# EAGLE design stwin_inclinometer (EAGLE 9.6.2)

## Sheet 1 of 3
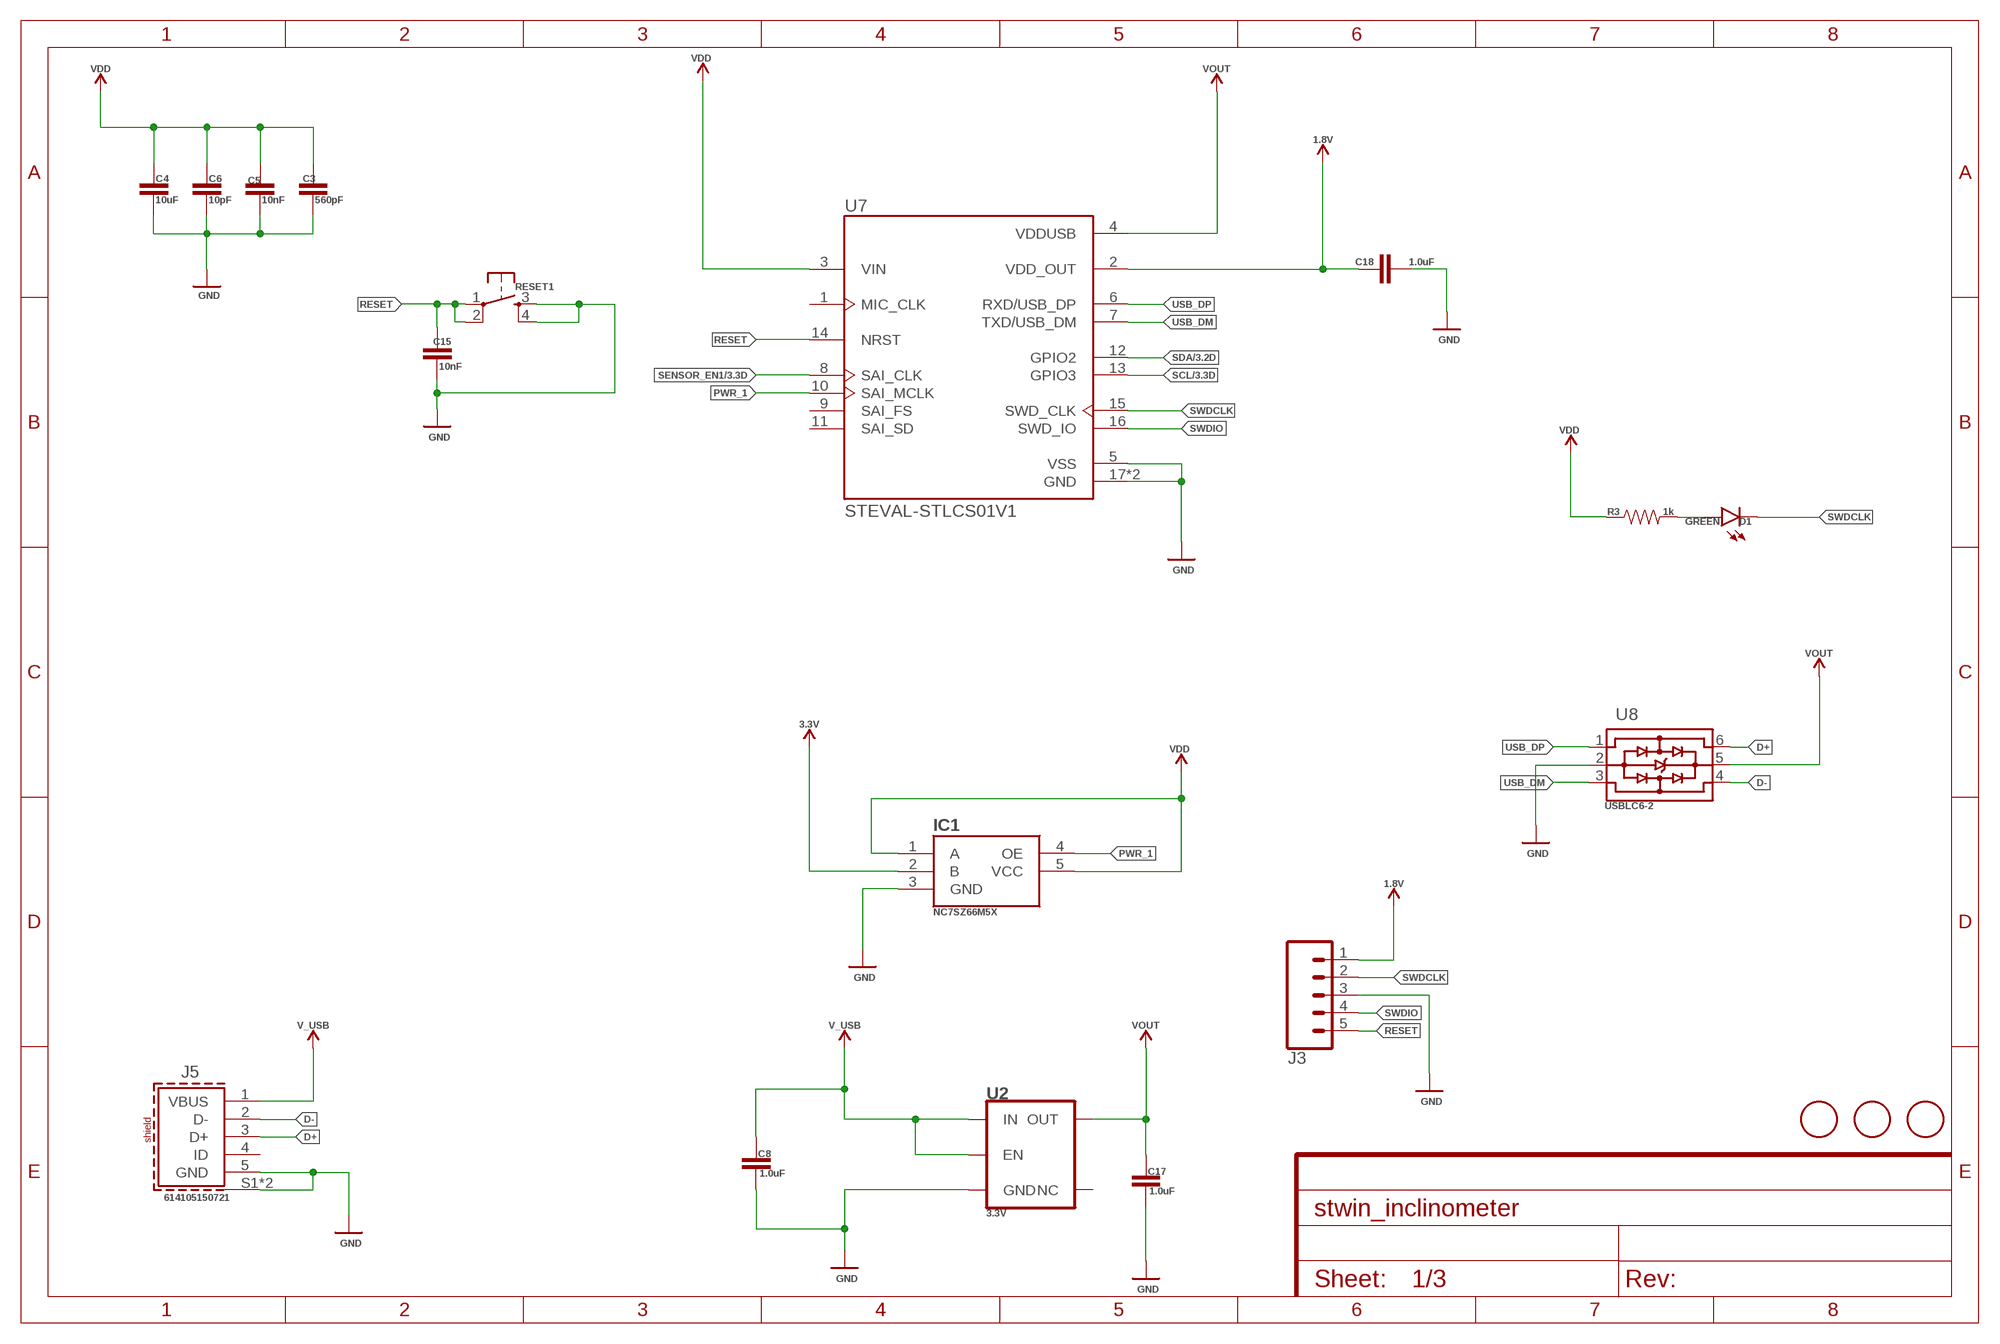
[diagram p0: schematic, sheet 1]

### Parts
C3  560pF  560PF-0603-50V-5%  [0603]
C4  10uF  10UF-0603-6.3V-20%  [0603]
C5  10nF  10NF-0603-50V-10%  [0603]
C6  10pF  10PF-0603-50V-5%  [0603]
C8  1.0uF  1.0UF-0603-16V-10%  [0603]
C15  10nF  10NF-0603-50V-10%  [0603]
C17  1.0uF  1.0UF-0603-16V-10%  [0603]
C18  1.0uF  1.0UF-0603-16V-10%  [0603]
D1  GREEN  LED-GREEN0603  [LED-0603]
IC1  NC7SZ66M5X  [SOT95P280X145-5N]
J3  CONN_05LOCK_LONGPADS  [1X05_LOCK_LONGPADS]
J5  614105150721  [614105150721]
R3  1k  1KOHM-0603-1/10W-1%  [0603]
RESET1  MOMENTARY-SWITCH-SPST-2-SMD-4.6X2.8MM  [TACTILE_SWITCH_SMD_4.6X2.8MM]
U2  3.3V  V_REG_AP2112K-3.3V  [SOT23-5]
U7  STEVAL-STLCS01V1  [XDCR_STEVAL-STLCS01V1]
U8  USBLC6-2  [USBLC6-2P6]
U$5  FIDUCIAL  [FIDUCIAL_1MM]
U$6  FIDUCIAL  [FIDUCIAL_1MM]
U$7  FIDUCIAL  [FIDUCIAL_1MM]

### Nets
1.8V: C18.1 J3.1 U7.2(VDD_OUT) ; also sheet 3
3.3V: IC1.2(B) ; also sheet 3
D+: J5.3(D+) U8.6
D-: J5.2(D-) U8.4
GND: C3.1 C4.1 C5.1 C6.1 C8.2 C15.1 C17.2 C18.2 IC1.3(GND) J3.3 J5.5(GND) J5.S1(SHIELD) J5.S2(SHIELD) RESET1.3 RESET1.4 U2.2(GND) U7.5(VSS) U7.17(GND) U7.18(GND) U8.2 ; also sheet 2,3
N$1: D1.A R3.2
PWR_1: IC1.4(OE) U7.10(SAI_MCLK)
RESET: C15.2 J3.5 RESET1.1 RESET1.2 U7.14(NRST)
SCL: U7.13(GPIO3) ; also sheet 3
SDA: U7.12(GPIO2) ; also sheet 3
SENSOR_EN1: U7.8(SAI_CLK) ; also sheet 3
SWDCLK: D1.C J3.2 U7.15(SWD_CLK)
SWDIO: J3.4 U7.16(SWD_IO)
USB_DM: U7.7(TXD/USB_DM) U8.3
USB_DP: U7.6(RXD/USB_DP) U8.1
V_USB: C8.1 J5.1(VBUS) U2.1(IN) U2.3(EN)
VDD: C3.2 C4.2 C5.2 C6.2 IC1.1(A) IC1.5(VCC) R3.1 U7.3(VIN) ; also sheet 2
VOUT: C17.1 U2.5(OUT) U7.4(VDDUSB) U8.5
Unconnected: J5.4(ID) U2.4(NC) U7.1(MIC_CLK) U7.9(SAI_FS) U7.11(SAI_SD)

## Sheet 2 of 3
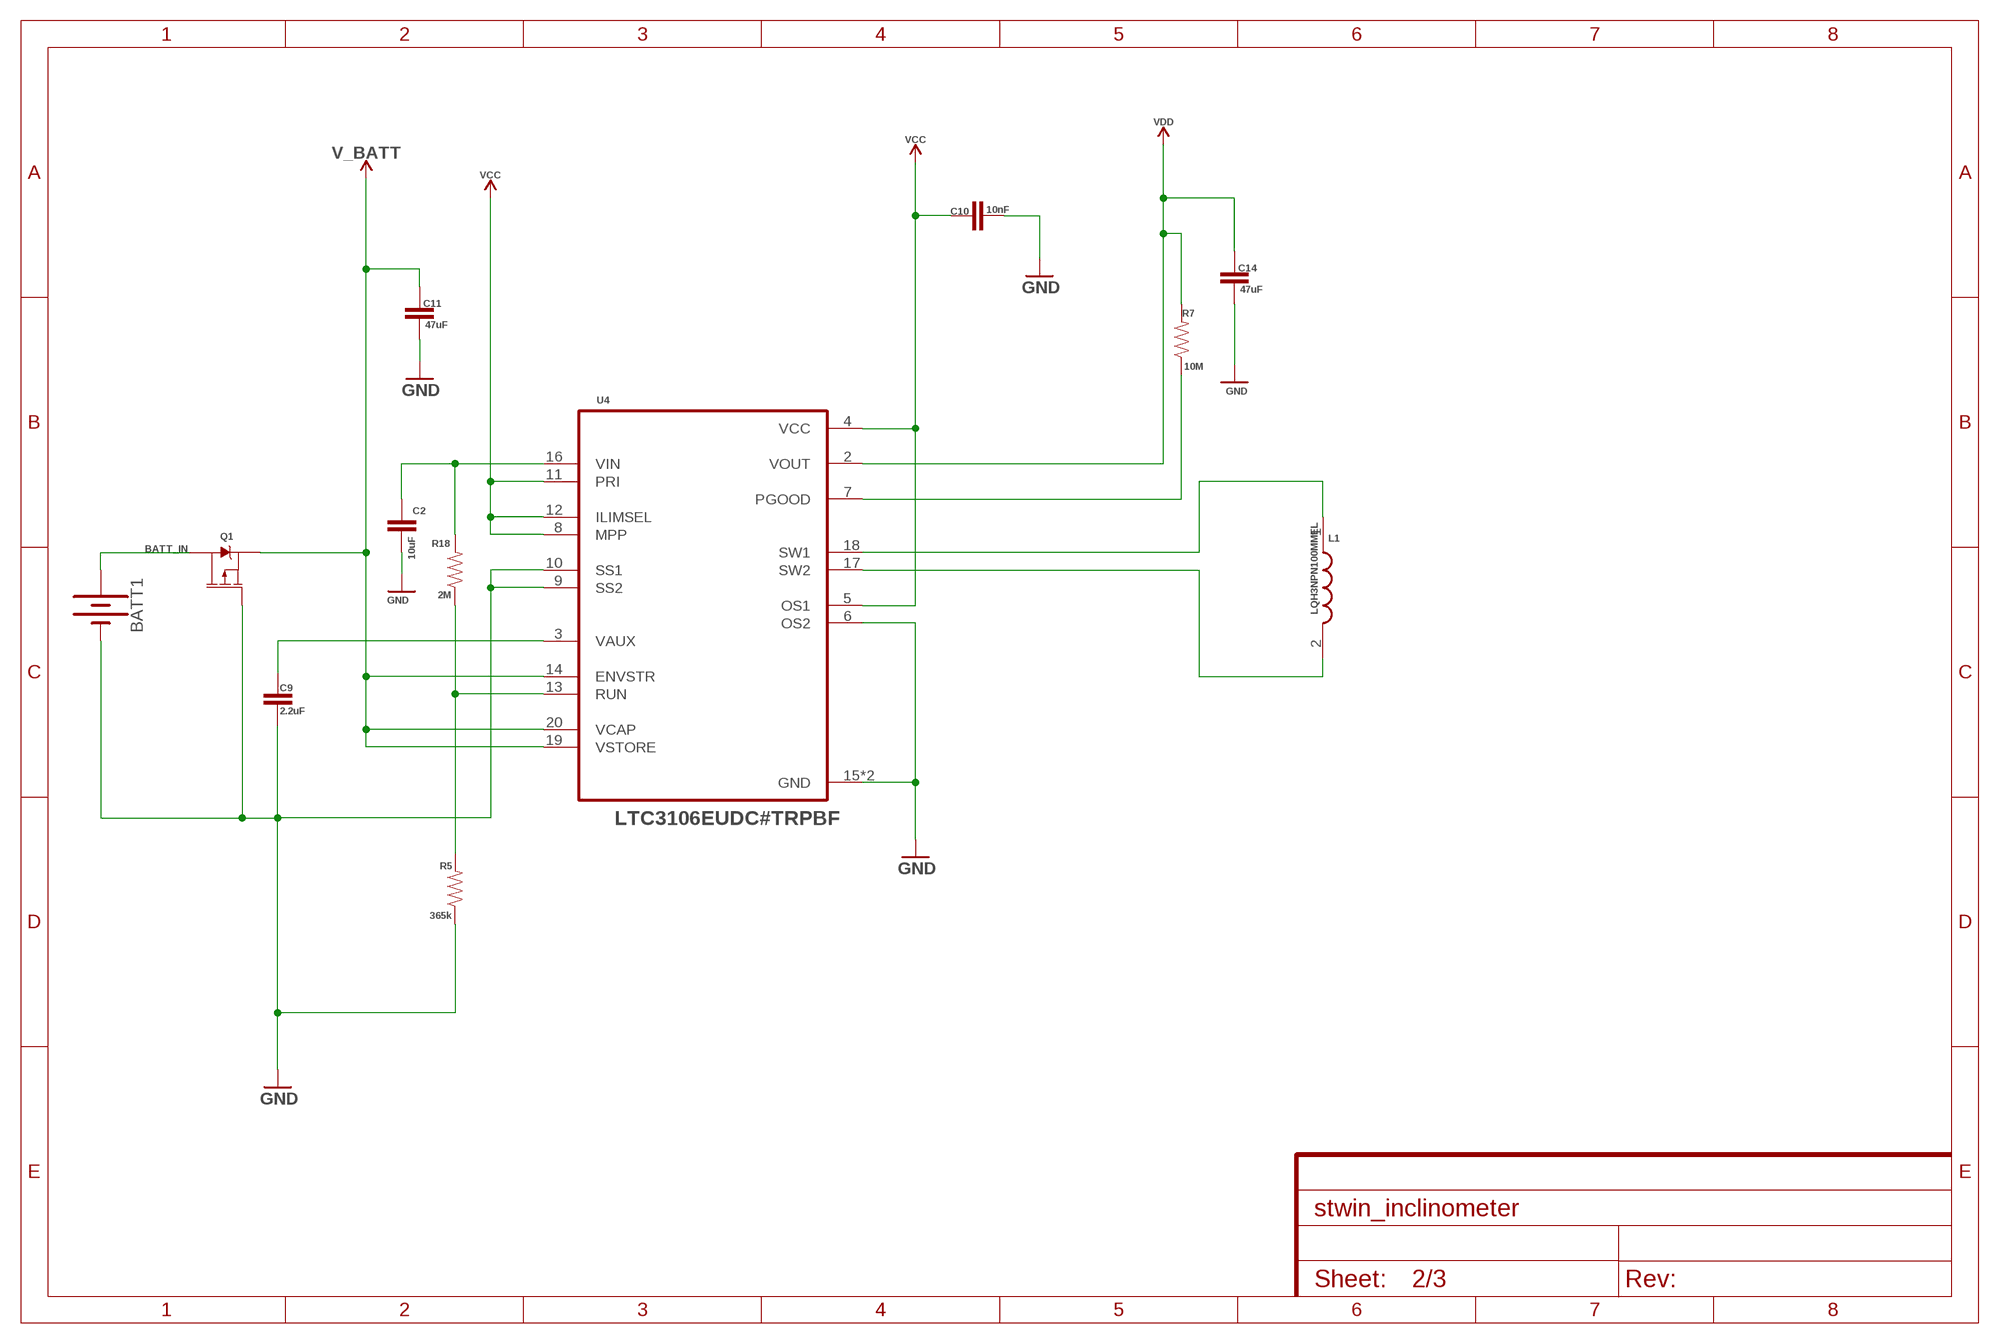
[diagram p1: schematic, sheet 2]

### Parts
BATT1  KEYSTONE_54KEYSTONE_2  [KEYSTONE_V2]
C2  10uF  10UF-0603-6.3V-20%  [0603]
C9  2.2uF  2.2UF-0603-10V-20%  [0603]
C10  10nF  10NF-0603-50V-10%  [0603]
C11  47uF  4.7UF0603  [0603]
C14  47uF  4.7UF0603  [0603]
L1  LQH3NPN100MMEL  [INDPM3030X150N]
Q1  2.5A/30V/105mΩ  MOSFET_PCH-DMG2307L  [SOT23-3]
R5  365k  348KOHM-0603-1/10W-1%  [0603]
R7  10M  10MOHM-0603-1/10W-5%  [0603]
R18  2M  1MOHM-0603-1/4W-5%  [0603]
U4  LTC3106EUDC#TRPBF  [QFN50P400X300X80-21N]

### Nets
BATT_IN: BATT1.P$1(+) BATT1.P$2(+) BATT1.P$3(+) Q1.3(D)
GND: BATT1.P$4(-) BATT1.P$5(-) BATT1.P$6(-) C2.2 C9.2 C10.2 C11.2 C14.2 Q1.1(G) R5.1 U4.6(OS2) U4.9(SS2) U4.10(SS1) U4.15(GND) U4.21(GND) ; also sheet 1,3
N$2: L1.1 U4.18(SW1)
N$3: L1.2 U4.17(SW2)
N$4: R7.1 U4.7(PGOOD)
N$7: C9.1 U4.3(VAUX)
N$9: C2.1 R18.2 U4.16(VIN)
N$10: R5.2 R18.1 U4.13(RUN)
V_BATT: C11.1 Q1.2(S) U4.14(ENVSTR) U4.19(VSTORE) U4.20(VCAP)
VCC: C10.1 U4.4(VCC) U4.5(OS1) U4.8(MPP) U4.11(PRI) U4.12(ILIMSEL)
VDD: C14.1 R7.2 U4.2(VOUT) ; also sheet 1

## Sheet 3 of 3
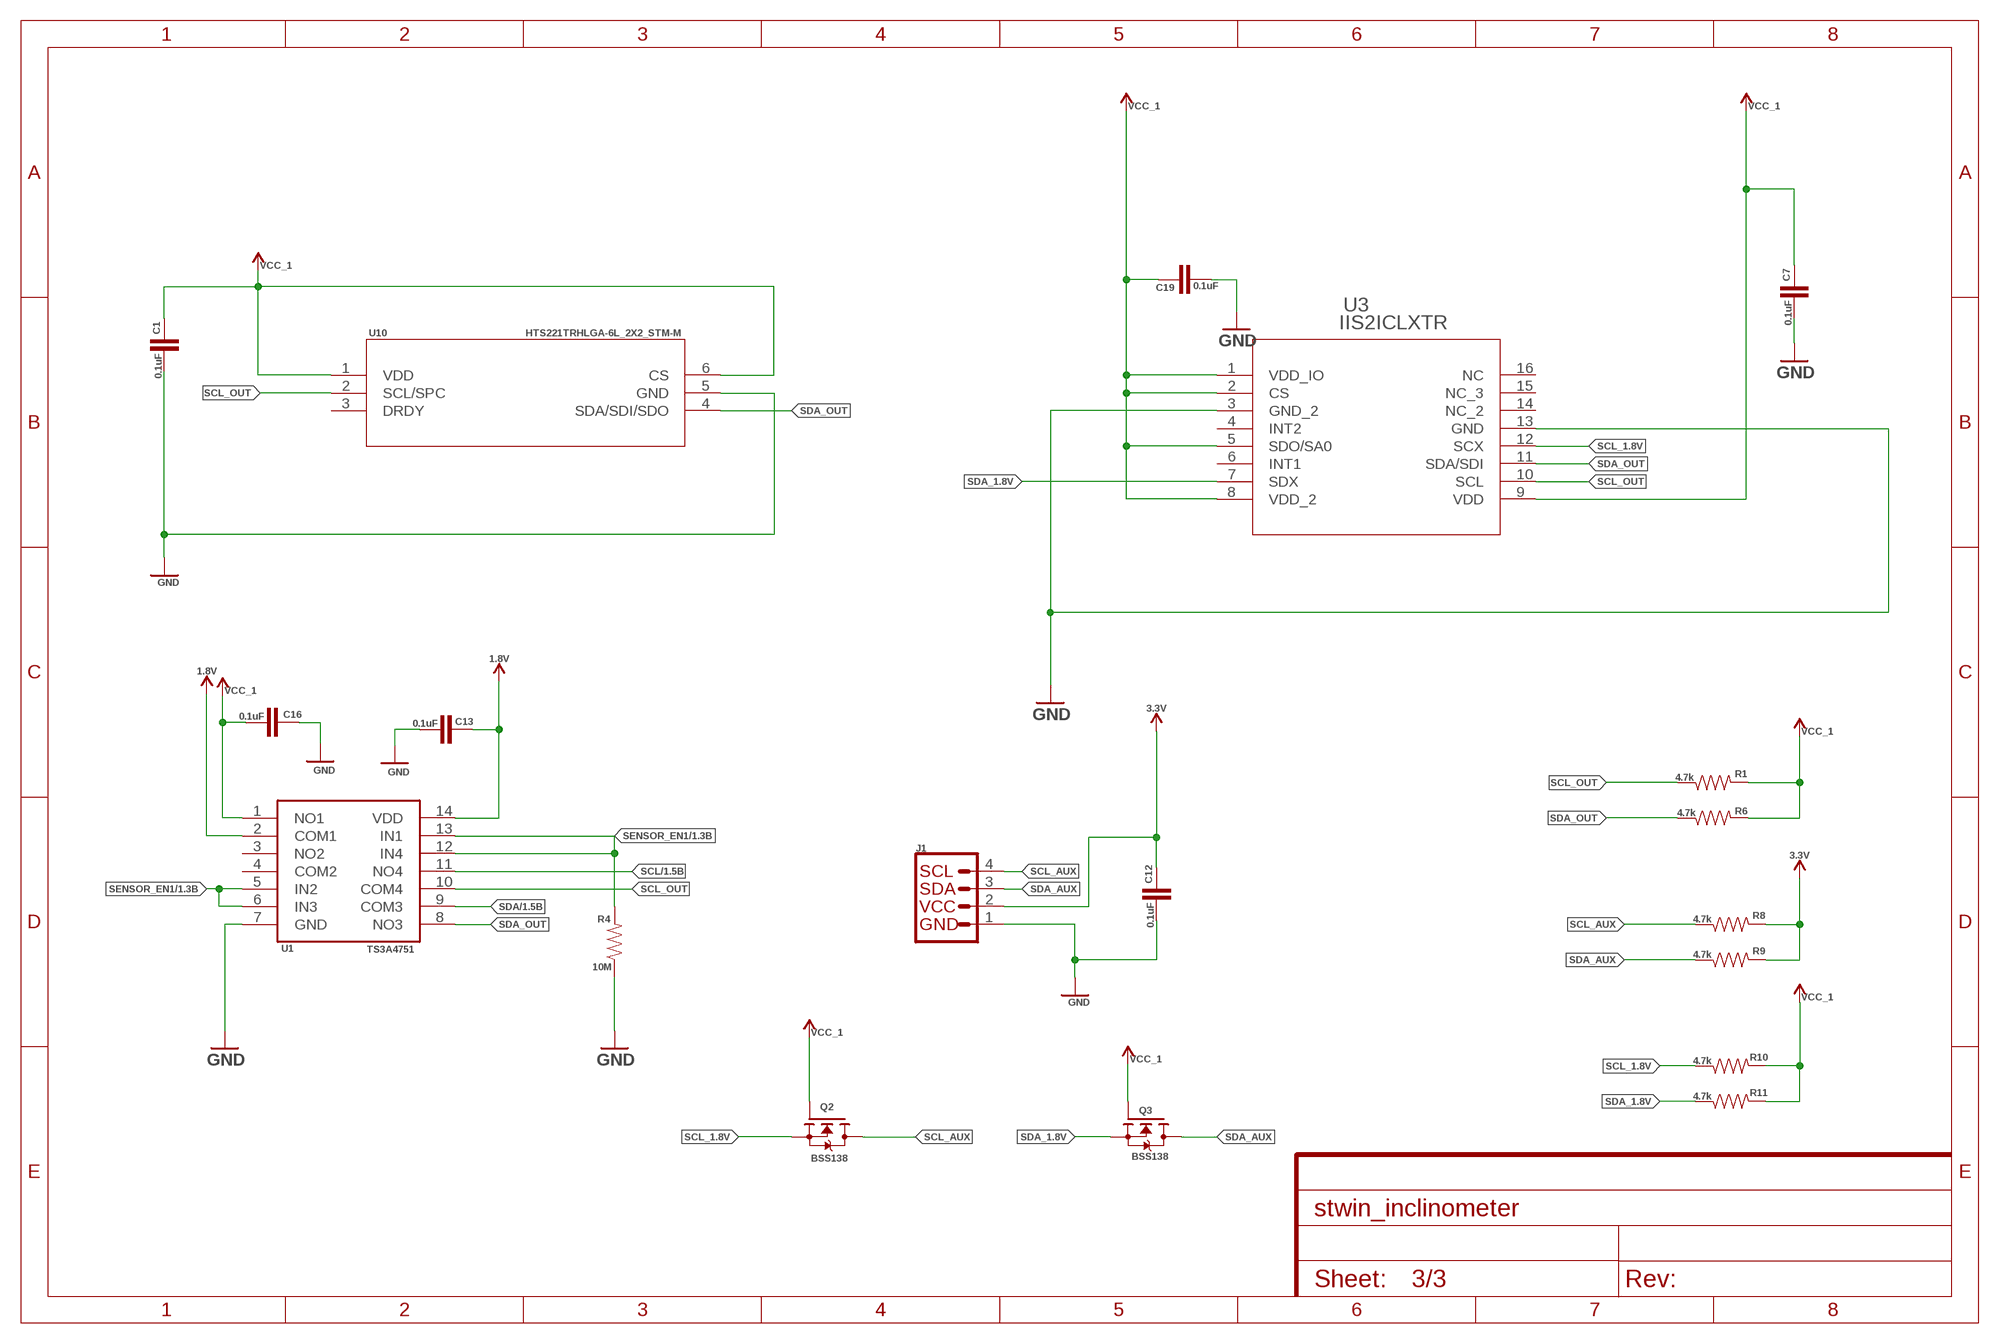
[diagram p2: schematic, sheet 3]

### Parts
C1  0.1uF  0.1UF-0603-25V-(+80/-20%)  [0603]
C7  0.1uF  0.1UF-0603-25V-(+80/-20%)  [0603]
C12  0.1uF  0.1UF-0603-25V-(+80/-20%)  [0603]
C13  0.1uF  0.1UF-0603-25V-(+80/-20%)  [0603]
C16  0.1uF  0.1UF-0603-25V-(+80/-20%)  [0603]
C19  0.1uF  0.1UF-0603-25V-(+80/-20%)  [0603]
J1  I2C_STANDARD  [1X04]
Q2  BSS138  [SOT95P240X111-3N]
Q3  BSS138  [SOT95P240X111-3N]
R1  4.7k  4.7KOHM-0603-1/10W-1%  [0603]
R4  10M  10MOHM-0603-1/10W-5%  [0603]
R6  4.7k  4.7KOHM-0603-1/10W-1%  [0603]
R8  4.7k  4.7KOHM-0603-1/10W-1%  [0603]
R9  4.7k  4.7KOHM-0603-1/10W-1%  [0603]
R10  4.7k  4.7KOHM-0603-1/10W-1%  [0603]
R11  4.7k  4.7KOHM-0603-1/10W-1%  [0603]
U1  TS3A4751  [14_PIN]
U3  IIS2ICLXTR  [QFN_ICLX_STM]
U10  HTS221TRHLGA-6L_2X2_STM-M  [HLGA-6L_2X2_STM-M]

### Nets
1.8V: C13.1 U1.2(COM1) U1.14(VDD) ; also sheet 1
3.3V: C12.1 J1.2 R8.2 R9.2 ; also sheet 1
GND: C1.2 C7.2 C12.2 C13.2 C16.1 C19.2 J1.1 R4.1 U1.7(GND) U3.3(GND_2) U3.13(GND) U10.5(GND) ; also sheet 1,2
SCL: U1.11(NO4) ; also sheet 1
SCL_1.8V: Q2.2(S) R10.1 U3.12(SCX)
SCL_AUX: J1.4 Q2.3(D) R8.1
SCL_OUT: R1.1 U1.10(COM4) U3.10(SCL) U10.2(SCL/SPC)
SDA: U1.9(COM3) ; also sheet 1
SDA_1.8V: Q3.2(S) R11.1 U3.7(SDX)
SDA_AUX: J1.3 Q3.3(D) R9.1
SDA_OUT: R6.1 U1.8(NO3) U3.11(SDA/SDI) U10.4(SDA/SDI/SDO)
SENSOR_EN1: R4.2 U1.5(IN2) U1.6(IN3) U1.12(IN4) U1.13(IN1) ; also sheet 1
VCC_1: C1.1 C7.1 C16.2 C19.1 Q2.1(G) Q3.1(G) R1.2 R6.2 R10.2 R11.2 U1.1(NO1) U3.1(VDD_IO) U3.2(CS) U3.5(SDO/SA0) U3.8(VDD_2) U3.9(VDD) U10.1(VDD) U10.6(CS)
Unconnected: U1.3(NO2) U1.4(COM2) U3.4(INT2) U3.6(INT1) U3.14(NC_2) U3.15(NC_3) U3.16(NC) U10.3(DRDY)

## Library data of the parts
BATT1 = battery_54:KEYSTONE_54
C1 C7 C12 C13 C16 C19 = SparkFun-Capacitors:0.1UF: 0.1µF ceramic capacitors A capacitor is a passive two-terminal electrical component used to store electrical energy temporarily in an electric field.; PROD_ID: CAP-00810
C2 C4 = SparkFun-Capacitors:10UF: 10.0µF ceramic capacitors A capacitor is a passive two-terminal electrical component used to store electrical energy temporarily in an electric field.; PROD_ID: CAP-11015
C3 = SparkFun-Capacitors:560PF: 0.56nF/560pF ceramic capacitors A capacitor is a passive two-terminal electrical component used to store electrical energy temporarily in an electric field.; PROD_ID: CAP-08749
C5 C10 C15 = SparkFun-Capacitors:10NF: 0.01uF/10nF/10,000pF ceramic capacitors A capacitor is a passive two-terminal electrical component used to store electrical energy temporarily in an electric field. CAP-09321; PROD_ID: CAP-00867
C6 = SparkFun-Capacitors:10PF: 10pF ceramic capacitors A capacitor is a passive two-terminal electrical component used to store electrical energy temporarily in an electric field.; PROD_ID: CAP-11812
C8 C17 C18 = SparkFun-Capacitors:1.0UF: 1µF ceramic capacitors A capacitor is a passive two-terminal electrical component used to store electrical energy temporarily in an electric field.; PROD_ID: CAP-00868
C9 = SparkFun-Capacitors:2.2UF: 2.2µF ceramic capacitors A capacitor is a passive two-terminal electrical component used to store electrical energy temporarily in an electric field.; PROD_ID: CAP-07888
C11 C14 = SparkFun-Capacitors:4.7UF: 4.7µF ceramic capacitors A capacitor is a passive two-terminal electrical component used to store electrical energy temporarily in an electric field.; PROD_ID: CAP-08280; VALUE: 4.7uF
D1 = SparkFun-LED:LED-GREEN: Green SMD LED Used in manufacturing of various products at SparkFun Packages: 0603 - SMD 0603 package [Product Link] <http://www.futureelectronics.com/en/technologies/semiconductors/optoelectronics/leds/Pages/9894312-LTST-C190GKT.aspx?CrossPart=HSMG-C190&IM=0> LilyPad 1206 - SMD1206 LilyPad package [Product Link] <http://www.futureelectronics.com/en/Technologies/Product.aspx?ProductID=IN150NGHARVATEKCORPORATION2049943&IM=0> 1206 - SMD1206 package [Product Link] <http://www.futureelectronics.com/en/technologies/semiconductors/optoelectronics/leds/Pages/8315665-LTST-C150KGKT.aspx?IM=0> 1206 Bottom Mount -SMD 1206 Bottom Mount [Product Link] <http://www.digikey.com/product-detail/en/lite-on-inc/LTST-C230KGKT/160-1456-1-ND/386854> SparkFun Products: Pro Mini 328 -5V <https://www.sparkfun.com/products/821> RedBoard <https://www.sparkfun.com/products/12757> MP3 Trigger <https://www.sparkfun.com/products/13720> Makey Makey <https://www.sparkfun.com/products/11076>; PROD_ID: DIO-00821
IC1 = SamacSys_Parts:NC7SZ66M5X: NC7SZ66M5X, Analogue SPST Switch Single SPST, 3 V, 5 V, 5-Pin, SOT-23, 1 Source: Datasheet <https://componentsearchengine.com/Datasheets/1/NC7SZ66M5X.pdf>; DESCRIPTION: NC7SZ66M5X, Analogue SPST Switch Single SPST, 3 V, 5 V, 5-Pin, SOT-23, 1; HEIGHT: 1.45mm; MANUFACTURER_NAME: ON Semiconductor; MANUFACTURER_PART_NUMBER: NC7SZ66M5X; MOUSER_PART_NUMBER: 512-NC7SZ66M5X; MOUSER_PRICE-STOCK: https://www.mouser.com/Search/Refine.aspx?Keyword=512-NC7SZ66M5X
J1 = SparkFun-Connectors:I2C_STANDARD: SparkFun I2C Standard Pinout Header SparkFun has standardized on a pinout for all I2C based sensor breakouts. This pinout allows I2C boards to be plugged directly into the headers on Arduino Uno compatible boards, and to be daisy chained easily. Example SparkFun Products: SparkFun Atmospheric Sensor Breakout - BME280 <https://www.sparkfun.com/products/13676> SparkFun Altitude/Pressure Sensor Breakout - MPL3115A2 <https://www.sparkfun.com/products/11084> SparkFun TOF Range Finder Sensor - VL6180 <https://www.sparkfun.com/products/12785>
J3 = SparkFun-Connectors:CONN_05: Multi connection point. Often used as Generic Header-pin footprint for 0.1 inch spaced/style header connections On any of the 0.1 inch spaced packages, you can populate with these: Break Away Headers - Straight <https://www.sparkfun.com/products/116> (PRT-00116) Break Away Male Headers - Right Angle <https://www.sparkfun.com/products/553> (PRT-00553) Female Headers <https://www.sparkfun.com/products/115> (PRT-00115) Break Away Headers - Machine Pin <https://www.sparkfun.com/products/117> (PRT-00117) Break Away Female Headers - Swiss Machine Pin <https://www.sparkfun.com/products/743> (PRT-00743) For SCREWTERMINALS and SPRING TERMINALS visit here: Screw Terimnals on SparkFun.com <https://www.sparkfun.com/search/results?term=Screw+Terminals> (5mm/3.5mm/2.54mm spacing) This device is also useful as a general connection point to wire up your design to another part of your project. Our various solder wires solder well into these plated through hole pads. Hook-Up Wire - Assortment (Stranded, 22 AWG) <https://www.sparkfun.com/products/11375> (PRT-11375) Hook-Up Wire - Assortment (Solid Core, 22 AWG) <https://www.sparkfun.com/products/11367> (PRT-11367) View the entire wire category on our website here <https://www.sparkfun.com/categories/141> Special notes: Molex polarized connector foot print use with SKU : PRT-08231 with associated crimp pins and housings. 1MM SMD Version SKU: PRT-10208
J5 = 614105150721:614105150721: WR-COM Micro USB 2.0 Type B Vertical 5 Contacts Kind Properties Durability:10 000 Mating cycles Quality Class:10 000 Mating cycles Connector Type:Micro USB Gender:Receptacle Type:Vertical General Information Operating Temperature:-40up to +105 °C Compliance:RoHS Electrical Properties IR 1:1.8A Working Voltage:30V (AC) Withstanding Voltage:100V (AC) Contact Resistance:30 mΩ Material Properties Insulator Material:LCP Insulator Flammability Rating:UL94 V-0 Color:Black Contact Material:Copper Alloy Contact Plating: Gold Contact Type:Stamped Shielding Material:Stainless Steel Shielding Plating:Matte Tin <https://www.we-online.com/catalog/media/o72645v209%20Family_WR-COM_Micro-USB-Type-B_Vertical_614105150721.jpg> Details see: https://www.we-online.com/catalog/en/COM_MICRO_TYPE_B_VERTICAL/ Updated by Yingchun, Shan 2020-01-16 2020 (C) Würth Elektronik; DESCRIPTION: USB - micro B USB 2.0 Receptacle Connector 5 Position Through Hole; MF: Wurth Electronics; MP: 614105150721; PACKAGE: None; PURCHASE-URL: https://pricing.snapeda.com/search/part/614105150721/?ref=eda
L1 = SamacSys_Parts:LQH3NPN100MMEL: Fixed Inductors 10uH 1280mA 0.228ohm SRF=20MHz(min) Source: Datasheet <https://componentsearchengine.com/Datasheets/1/LQH3NPN100MMEL.pdf>; DESCRIPTION: Fixed Inductors 10uH 1280mA 0.228ohm SRF=20MHz(min); HEIGHT: 1.5mm; MANUFACTURER_NAME: Murata Electronics; MANUFACTURER_PART_NUMBER: LQH3NPN100MMEL; MOUSER_PART_NUMBER: 81-LQH3NPN100MMEL; MOUSER_PRICE-STOCK: https://www.mouser.com/Search/Refine.aspx?Keyword=81-LQH3NPN100MMEL
Q1 = SparkFun-DiscreteSemi:MOSFET_PCH: P-channel MOSFETs Voltage controlled devices that allow control of high current outputs. SparkFun Products: SparkFun ESP32 Thing <https://www.sparkfun.com/products/13907> SparkFun ESP8266 Thing <https://www.sparkfun.com/products/13231>; PROD_ID: TRANS-11308
Q2 Q3 = BSS138:BSS138: N-Channel 50V 220mA (Ta) 360mW (Ta) Surface Mount SOT-23-3 Check prices <https://pricing.snapeda.com/parts/BSS138/ON%20Semiconductor/view-part?ref=eda>; AVAILABILITY: Good; DESCRIPTION: N-Channel 50V 220mA (Ta) 360mW (Ta) Surface Mount SOT-23-3; MF: ON Semiconductor; MP: BSS138; PACKAGE: SOT-23 ON Semiconductor; PRICE: None; PURCHASE-URL: https://pricing.snapeda.com/search/part/BSS138/?ref=eda
R1 R6 R8-R11 = SparkFun-Resistors:4.7KOHM: 4.7kΩ resistor A resistor is a passive two-terminal electrical component that implements electrical resistance as a circuit element. Resistors act to reduce current flow, and, at the same time, act to lower voltage levels within circuits. - Wikipedia; PROD_ID: RES-07857
R3 = SparkFun-Resistors:1KOHM: 1kΩ resistor A resistor is a passive two-terminal electrical component that implements electrical resistance as a circuit element. Resistors act to reduce current flow, and, at the same time, act to lower voltage levels within circuits. - Wikipedia; PROD_ID: RES-07856
R4 R7 = SparkFun-Resistors:10MOHM: RES-09327; PROD_ID: RES-08283
R5 = SparkFun-Resistors:348KOHM: 348kΩ resistor A resistor is a passive two-terminal electrical component that implements electrical resistance as a circuit element. Resistors act to reduce current flow, and, at the same time, act to lower voltage levels within circuits. - Wikipedia; PROD_ID: RES-12533; VALUE: 348k
R18 = SparkFun-Resistors:1MOHM: 1MΩ resistor A resistor is a passive two-terminal electrical component that implements electrical resistance as a circuit element. Resistors act to reduce current flow, and, at the same time, act to lower voltage levels within circuits. - Wikipedia; PROD_ID: RES-07868; VALUE: 1M
RESET1 = SparkFun-Switches:MOMENTARY-SWITCH-SPST-2: Momentary Switch (Pushbutton) - SPST - Two Circuits Normally-open (NO) SPST momentary switches (buttons, pushbuttons). Schematic symbol includes two switch circuits. Variants SMD-4.6MMX2.8MM - 4.60mm x 2.80mm Tactile Momentary Button Switch - Used on SparkFun SAMD21 Mini Breakout <https://www.sparkfun.com/products/13664> SMD-5.2MM - Mini Pushbutton Switch - SMD <https://www.sparkfun.com/products/8720> - Used on Arduino Pro Mini <https://www.sparkfun.com/products/11114>; PROD_ID: SWCH-13065
U1 = TS3A4751:TS3A4751: TS3A4751 Quad Switch; AVAILABILITY: Unavailable; DESCRIPTION: 0.9 Ohm Low-Voltage Single-Supply Quad SPST Analog Switch; MF: Texas Instruments; MP: TS3A4751; PACKAGE: TSSOP-14 Texas Instruments; PRICE: None
U2 = SparkFun-IC-Power:V_REG_AP2112: AP2112 - 600mA CMOS LDO Regulator w/ Enable The AP2112 is CMOS process low dropout linear regulator with enable function, the regulator delivers a guaranteed 600mA (min.) continuous load current. Features Output Voltage Accuracy: ±1.5% Output Current: 600mA (Min.) Foldback Short Current Protection: 50mA Enable Function to Turn ON/OFF VOUT Low Dropout Voltage (3.3V): 250mV (Typ.) @IOUT=600mA Excellent Load Regulation: 0.2%/A (Typ.) Excellent Line Regulation: 0.02%/V (Typ.) Low Quiescent Current: 55μA (Typ.) Low Standby Current: 0.01μA (Typ.) Low Output Noise: 50μVRMS PSRR: 100Hz -65dB, 1kHz -65dB OTSD Protection Stable with 1.0μF Flexible Cap: Ceramic, Tantalum and Aluminum Electrolytic Operation Temperature Range: -40°C to 85°C ESD: MM 400V, HBM 4000V; PROD_ID: VREG-12457
U3 = iis2iclx:IIS2ICLXTR; BUILT_BY: EMA_Matt; COPYRIGHT: Copyright (C) 2018 Accelerated Designs. All rights reserved; DATASHEET: https://www.st.com/resource/en/datasheet/iis2iclx.pdf; MANUFACTURER_PART_NUMBER: IIS2ICLXTR; SOURCELIBRARY: Updates_to_database_2020-11-03; VENDOR: STMicroelectronics
U4 = LTC3106EUDC_TRPBF:LTC3106EUDC#TRPBF: LTC3106 - 300mA Low Voltage Buck-Boost Converter with PowerPath and 1.6μA Quiescent Current; AVAILABILITY: Unavailable; DESCRIPTION: LTC3106 - 300mA Low Voltage Buck-Boost Converter with PowerPath and 1.6μA Quiescent Current; MF: Linear Technology/Analog; MP: LTC3106EUDC#TRPBF; PACKAGE: QFN-20 Linear Technology; PRICE: None
U7 = STEVAL-STLCS01V1:STEVAL-STLCS01V1: Evaluation kit based on the STM32L476JGY6TR, LSM303AGRTR, LSM6DSMTR, BlueNRG-MSCSP, LPS22HBTR, MP34DT04 and BALF-NRG; AVAILABILITY: Unavailable; DESCRIPTION: BlueNRG-MS, LPS22HB, LSM6DSM, LSM303AGR, MP34DT04, STM32L4 SensorTile Accelerometer, Gyroscope, Humidity, Magnetometer, Pressure, Temperature Sensor Evaluation Board; MF: STMicroelectronics; MP: STEVAL-STLCS01V1; PACKAGE: None; PRICE: None
U8 = USBLC6-2:USBLC6-2; AVAILABILITY: Unavailable; DESCRIPTION: 17V Clamp 5A (8/20µs) Ipp Tvs Diode Surface Mount SOT-23-6; MF: STMicroelectronics; MP: USBLC6-2; PACKAGE: SOT-563 STMicroelectronics; PRICE: None
U10 = HTS221:HTS221TR; BUILT_BY: EMA_Anthony; COPYRIGHT: Copyright (C) 2018 Accelerated Designs. All rights reserved; DATASHEET: https://www.st.com/content/ccc/resource/technical/document/datasheet/4d/9a/9c/ad/25/07/42/34/DM00116291.pdf/files/DM00116291.pdf/jcr:content/translations/en.DM00116291.pdf; MANUFACTURER_PART_NUMBER: HTS221TR; SOURCELIBRARY: Updates_to_database_2020-11-03; VENDOR: STMicroelectronics
U$5-U$7 = adafruit:FIDUCIAL: For use by pick and place machines to calibrate the vision/machine, 1mm By microbuilder.eu

## Board
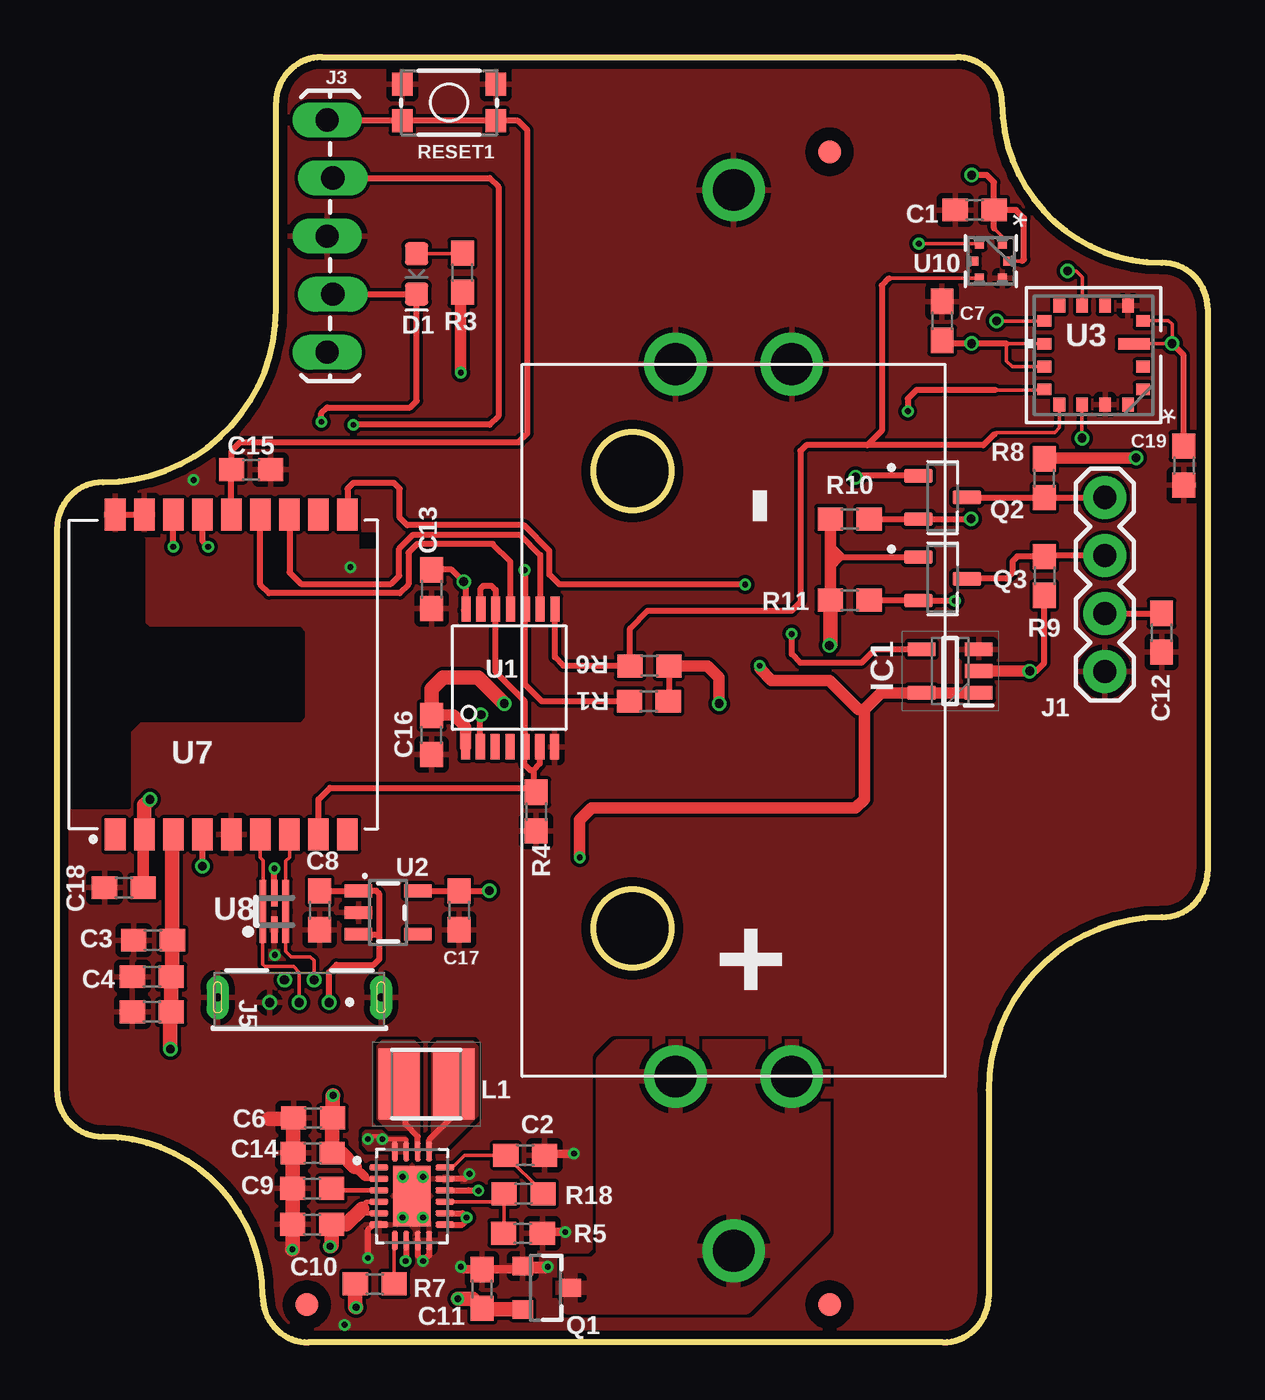
[diagram p3: board, top side]
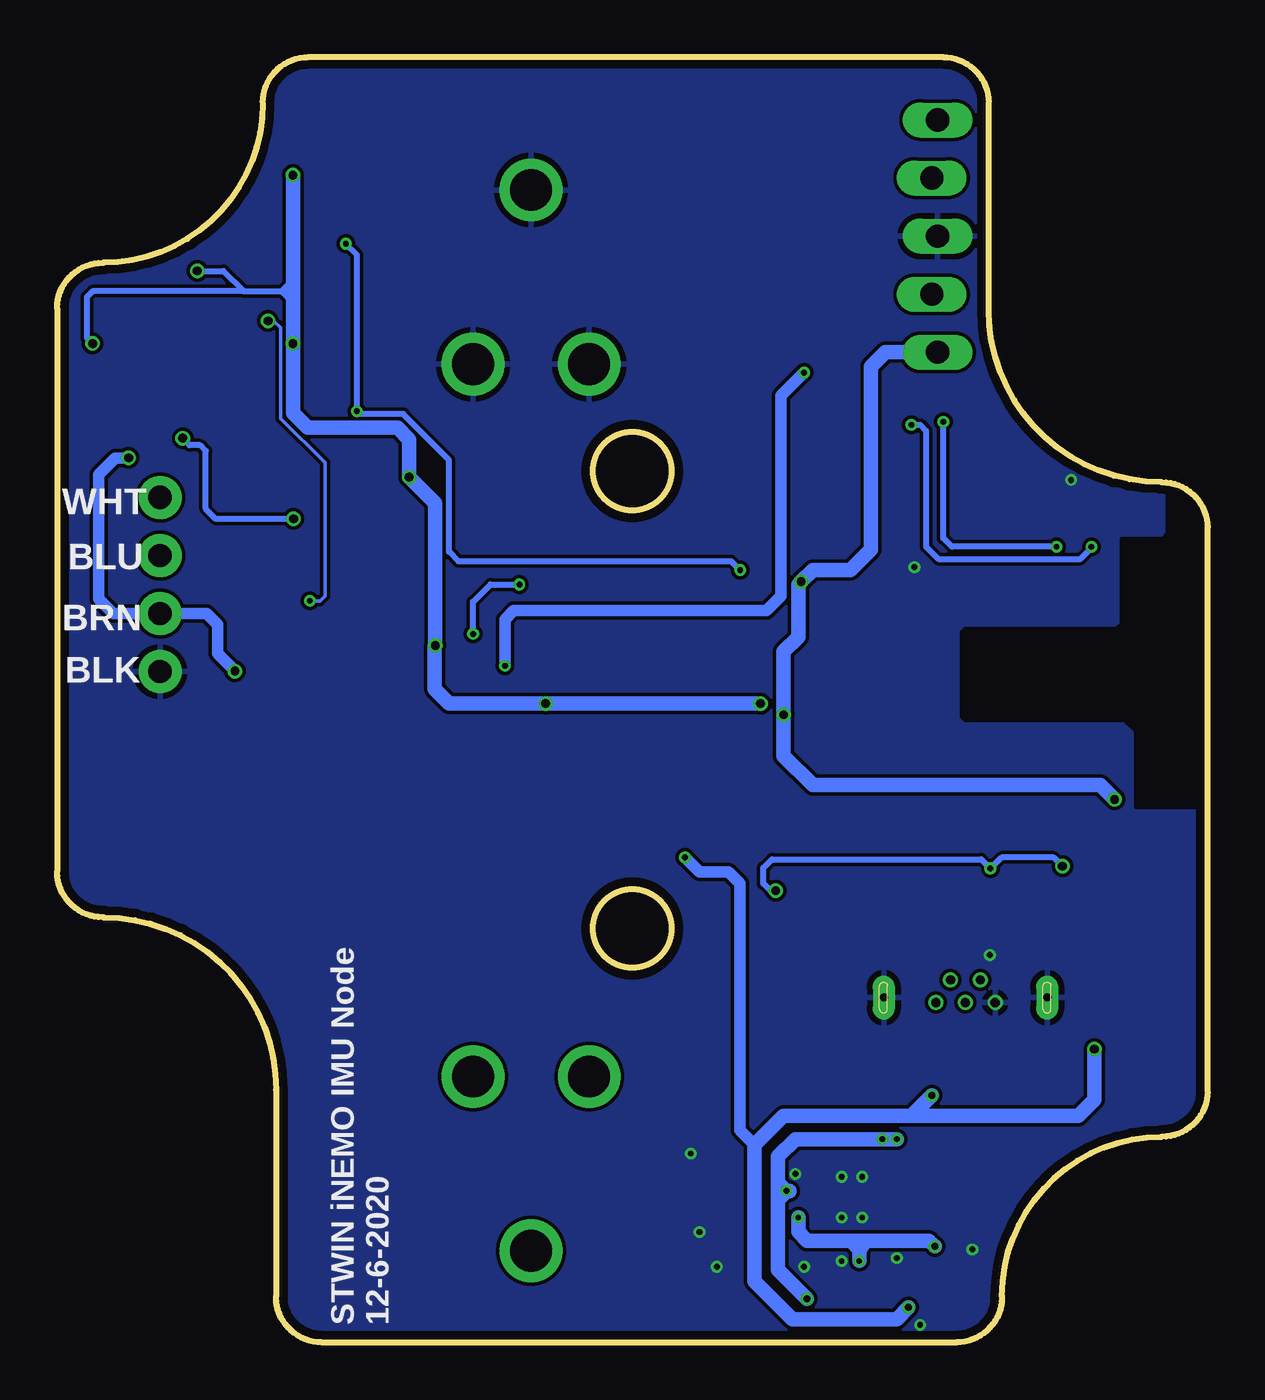
[diagram p4: board, bottom side, seen from below]

Size 50.32 x 56.21 mm. Coordinates in mm from the lower left corner, seen from the top.
Outline: 41.33,54.22 41.33,54.19 arc90 48.3,47.22 48.33,47.22 arc-90 50.32,45.23 50.32,20.59 arc-90 48.33,18.59 48.3,18.59 arc90 40.75,11.04 40.75,2 arc-90 38.75,0 10.99,0 arc-90 8.99,2 8.99,2.02 arc90 2.02,8.99 2,8.99 arc-90 0,10.99 0,35.63 arc-90 2,37.62 2.02,37.62 arc90 9.58,45.18 9.58,54.22 arc-90 11.57,56.22 39.33,56.22 arc-90 41.33,54.22
Outline: circle at 25.16,18.11 radius 1.71
Outline: circle at 25.16,38.11 radius 1.71
Copper layers (1*16): Top 0.035559375mm / dielectric 1.6mm / Bottom 0.035559375mm
Design rules "oshpark-2layer": minimum track width 6mil, minimum drill 10mil, track to track 6mil, track to pad 6mil, pad to pad 6mil, via to via 6mil, smd to smd 6mil, copper to edge 15mil, drill to drill 6mil, minimum pad ring 5mil, minimum via ring 5mil, stop-mask expansion 2.5mil, vias tented up to drill 0mil, thermal gap 10mil

### Footprints (pad centres in the part's own frame; a part is rotated, then mirrored left to right if it is on the bottom)
KEYSTONE_V2 = drill 1.829: P$1 15.58,2.54; P$2 15.58,-2.54; P$3 23.2,0; P$4 -15.58,2.54; P$5 -15.58,-2.54; P$6 -23.2,0
0603 = smd 1.1 x 1: 1 -0.85,0; 2 0.85,0
LED-0603 = smd 1 x 1: A -0.877,0; C 0.877,0
SOT95P280X145-5N = smd 1.2 x 0.6: 1 -1.25,0.95; 2 -1.25,0; 3 -1.25,-0.95; 4 1.25,-0.95; 5 1.25,0.95
1X04 = drill 1.016 pad 1.88: 1 0,0; 2 2.54,0; 3 5.08,0; 4 7.62,0
1X05_LOCK_LONGPADS = drill 1.016 long: 1 0,0; 2 2.54,-0.254; 3 5.08,0; 4 7.62,-0.254; 5 10.16,0
614105150721 = drill 0.4: 1 -1.3,0.125; 2 -0.65,-0.875; 3 0,0.125; 4 0.65,-0.875; 5 1.3,0.125 | drill 0.35 pad 0.97 long: S1 -3.575,-0.095; S2 3.575,-0.095
INDPM3030X150N = smd 1.8 x 3.1: 1 -1.2,0; 2 1.2,0
SOT23-3 = smd 0.8 x 0.9: 1 -0.95,-1; 2 0.95,-1; 3 0,1.1
SOT95P240X111-3N = smd 1.23 x 0.6: 1 -1.06,0.95; 2 -1.06,-0.95; 3 1.06,0
TACTILE_SWITCH_SMD_4.6X2.8MM = smd 0.9 x 1: 1 -2.05,-0.8; 2 2.05,-0.8; 3 2.05,0.8; 4 -2.05,0.8
14_PIN = smd 1.1 x 0.4: 1 -3.26,1.165; 2 -3.26,0.515; 3 -3.26,-0.135; 4 -3.26,-0.785; 5 -3.26,-1.435; 6 -3.26,-2.085; 7 -3.26,-2.735; 8 2.77,-2.755; 9 2.77,-2.105; 10 2.77,-1.455; 11 2.77,-0.805; 12 2.77,-0.155; 13 2.77,0.495; 14 2.77,1.145
SOT23-5 = smd 0.55 x 1.2: 1 -0.95,-1.3; 2 0,-1.3; 3 0.95,-1.3; 4 0.95,1.3; 5 -0.95,1.3
QFN_ICLX_STM = smd 1.397 x 0.508: 1 -1.767,-0.5 | smd 0.61 x 0.508: 2 -2.161,-1.5; 7 2.161,-1.5; 8 2.161,-0.5; 9 2.161,0.5; 10 2.161,1.5; 15 -2.161,1.5; 16 -2.161,0.5 | smd 0.508 x 0.61: 3 -1.5,-2.161; 4 -0.5,-2.161; 5 0.5,-2.161; 6 1.5,-2.161; 11 1.5,2.161; 12 0.5,2.161; 13 -0.5,2.161; 14 -1.5,2.161
QFN50P400X300X80-21N = smd 0.84 x 0.27: 1 -1.445,1.25; 2 -1.445,0.75; 3 -1.445,0.25; 4 -1.445,-0.25; 5 -1.445,-0.75; 6 -1.445,-1.25; 11 1.445,-1.25; 12 1.445,-0.75; 13 1.445,-0.25; 14 1.445,0.25; 15 1.445,0.75; 16 1.445,1.25 | smd 0.27 x 0.84: 7 -0.75,-1.945; 8 -0.25,-1.945; 9 0.25,-1.945; 10 0.75,-1.945; 17 0.75,1.945; 18 0.25,1.945; 19 -0.25,1.945; 20 -0.75,1.945 | smd 1.65 x 2.65: 21 0,0
XDCR_STEVAL-STLCS01V1 = smd 1.4 x 0.9: 1 -7,5.08; 2 -7,3.81; 3 -7,2.54; 4 -7,1.27; 5 -7,0; 6 -7,-1.27; 7 -7,-2.54; 8 -7,-3.81; 9 -7,-5.08; 10 7,-5.08; 11 7,-3.81; 12 7,-2.54; 13 7,-1.27; 14 7,0; 15 7,1.27; 16 7,2.54; 17 7,3.81; 18 7,5.08
USBLC6-2P6 = smd 0.3 x 1.46: 1 -0.5,-0.65; 3 0.5,-0.65; 4 0.5,0.65; 6 -0.5,0.65 | smd 0.3 x 1.16: 2 0,-0.8; 5 0,0.8
HLGA-6L_2X2_STM-M = smd 0.406 x 0.406: 1 -0.749,0.5; 2 -0.749,-0.5; 3 0,-0.749; 4 0.749,-0.5; 5 0.749,0.5; 6 0,0.749
FIDUCIAL_1MM = smd 1 x 1: 1 0,0

### Placement (x,y rotation side)
BATT1  29.59,27.2 270 top
C1  40.13,49.53 180 top
C2  20.47,8.18 0 top
C3  4.19,17.59 0 top
C4  4.14,16 0 top
C5  4.14,14.45 0 top
C6  11.2,9.81 0 top
C7  38.71,44.68 90 top
C8  11.48,18.9 270 top
C9  11.15,6.73 180 top
C10  11.15,5.16 180 top
C11  18.59,2.34 90 top
C12  48.31,31.04 270 top
C13  16.38,32.94 270 top
C14  11.18,8.28 180 top
C15  8.48,38.18 180 top
C16  16.38,26.57 90 top
C17  17.58,18.9 270 top
C18  2.92,19.89 180 top
C19  49.28,38.35 270 top
D1  15.72,46.74 270 top
IC1  39.07,29.36 180 top
J1  45.82,29.34 90 top
J3  11.81,43.31 90 top
J5  10.59,14.99 180 top
L1  16.15,11.3 0 top
Q1  21.36,2.39 270 top
Q2  38.73,36.96 0 top
Q3  38.73,33.4 0 top
R1  25.88,28.04 0 top
R3  17.73,46.79 90 top
R4  20.95,23.22 90 top
R5  20.37,4.78 180 top
R6  25.91,29.59 0 top
R7  13.89,2.57 180 top
R8  43.18,37.8 90 top
R9  43.18,33.53 270 top
R10  34.67,36.02 180 top
R11  34.67,32.46 180 top
R18  20.4,6.5 0 top
RESET1  17.14,54.23 0 top
U1  19.02,29.31 90 top
U2  14.48,18.8 270 top
U3  45.34,43.18 180 top
U4  15.52,6.4 0 top
U7  7.62,29.21 90 top
U8  9.5,18.85 0 top
U10  40.84,47.29 270 top
U$5  33.78,52.07 0 top
U$6  10.92,1.65 0 top
U$7  33.78,1.65 0 top

### Tracks (layer width: path | path; a pad name or v marks a point on that pad's centre or on a via)
1.8V  (via drill 0.38)
  Top 0.254: U1.2 18.51,27.43 v18.54,27.46 | U1.14 17.88,33.17 v17.78,33.27 17.26,33.79 C13.1
  Top 0.305: U1.14 17.81,32.02
  Top 0.508: C18.1 3.77,22.17 U7.2
  Top 0.635: U7.2 3.81,23.5 v4.06,23.75
  Bottom 0.635: v4.06,23.75 4.7,24.38 17.27,24.38 18.54,25.65 v18.54,27.46 18.54,30.23 17.91,30.86 17.91,33.15 v17.78,33.27 17.27,33.78 15.62,33.78 14.73,34.67 14.73,42.67 14.1,43.31 J3.1
3.3V  (via drill 0.38)
  Top 0.254: J1.2 48.3,31.88 C12.1 | v42.55,29.36 42.82,29.36 43.18,29.72 R9.2
  Top 0.508: v47.19,38.68 43.22,38.68 R8.2 | IC1.2 v42.55,29.36
  Bottom 0.508: v47.19,38.68 47.78,38.68 48.51,37.95 48.51,32.51 47.88,31.88 J1.2 43.79,31.88 43.31,31.39 43.31,30.12 v42.55,29.36
BATT_IN
  pour Top: 22.1,3.17 22.1,1.78 22.35,1.52 30.1,1.52 33.53,4.95 33.53,12.45 33.02,12.95 24.51,12.95 23.88,12.32 23.88,3.81 23.5,3.43 22.35,3.43
D+
  Top 0.152: J5.3 10.59,16.18 10.34,16.43 9.09,16.43 8.99,16.54 U8.6
D-
  Top 0.152: 10.03,19.46 U8.4 10,17.1 10.24,16.87 11.07,16.87 11.24,16.7 J5.2
GND  (via drill 0.25)
  Top 0.254: U4.9 15.77,3.79 v16,3.56 16.27,3.82 U4.10 | v18.03,7.37 17.82,7.15 U4.15 | U4.6 13.82,5.15 13.59,4.92 v13.59,3.68 | U4.21 15.11,6.81 v15.11,7.24 | 3.39,36.21 U7.17 U7.18
  Top 0.381: v17.65,3.3 17.77,3.19 C11.2 21.35,3.19 v21.46,3.3 21.43,3.34 Q1.1 | C2.2 21.4,8.26 v22.61,8.26 | R5.1 21.27,4.83 v22.23,4.83
  Top 0.635: 9.27,9.78 10.32,9.78 C6.1 10.33,9.79 C14.2 10.3,8.26 C9.2 C10.2 10.3,4.08 v10.29,4.06 | 3.27,15.97 C4.1
  other vias: 16,7.24 15.11,5.46 16,5.46 12.57,0.76 9.53,16.94 5.97,37.72 12.83,33.91
  pour Top (rank 6): 0.13,-0.38 0.13,22.86 0.51,23.24 3.17,23.24 3.3,23.37 3.3,26.67 3.68,27.05 10.67,27.05 10.92,27.3 10.92,31.11 10.67,31.37 4.06,31.37 3.94,31.5 3.94,34.67 3.94,35.18 3.81,35.31 2.03,35.31 1.91,35.43 1.91,37.21 2.03,37.34 2.03,56.26 2.54,56.77 49.91,56.77 50.42,56.26 50.42,-0.25 49.91,-0.76 0.51,-0.76
  pour Bottom: 0.25,-0.64 50.04,-0.64 50.42,-0.25 50.42,56.26 49.91,56.77 2.54,56.77 2.03,56.26 2.03,37.34 1.91,37.21 1.91,35.43 2.03,35.31 3.81,35.31 3.94,35.18 3.94,34.54 3.94,31.5 4.06,31.37 10.67,31.37 10.92,31.11 10.92,27.3 10.67,27.05 3.68,27.05 3.3,26.67 3.3,23.37 3.17,23.24 0.51,23.24 0.13,22.86 0.13,-0.51
N$1
  Top 0.152: D1.A 17.7,47.61 R3.2
N$2
  Top 0.254: U4.18 15.77,9 15.24,9.53 15.24,11.02 L1.1
  pour Top (no thermals): 13.97,12.95 13.97,9.78 14.48,9.27 15.37,9.27 15.62,9.02 15.75,9.02 15.88,9.14 15.88,12.95 15.62,13.21 14.22,13.21
N$3
  Top 0.254: U4.17 16.27,8.85 17.35,9.94 L1.2
  pour Top (no thermals): 16.64,13.21 18.16,13.21 18.41,12.95 18.41,9.91 16.89,8.38 16.38,8.38 16.26,8.51 16.26,9.02 16.38,9.14 16.38,12.95
N$4
  Top 0.152: R7.1 14.74,4.43 U4.7
N$7
  Top 0.203: U4.3 12.08,6.65 C9.1
N$9
  Top 0.152: U4.16 17.3,7.65 17.83,8.18 C2.1 21.25,6.55 R18.2
N$10
  Top 0.152: U4.13 19.2,6.15 R18.1 19.55,4.8 R5.2
PWR_1  (via drill 0.25)
  Top 0.254: IC1.4 35.77,30.31 35.18,29.72 32.51,29.72 32.13,30.1 v32.13,30.99 | v30.1,33.15 21.97,33.15 21.54,33.58 21.54,34.61 20.41,35.74 15.32,35.74 14.99,36.07 14.99,37.34 14.73,37.59 12.95,37.59 12.7,37.34 U7.10
  Bottom 0.254: v32.13,30.99 32.13,32.38 31.37,33.15 v30.1,33.15
RESET
  Top 0.254: J3.5 11.85,53.43 RESET1.1 RESET1.2 20.16,53.43 20.57,53.01 20.57,39.75 20.19,39.37 8,39.37 7.63,39 C15.2 7.62,38.16 U7.14
SCL
  Top 0.254: U1.11 19.83,34.15 19.05,34.92 15.75,34.92 15.37,34.54 15.37,33.15 14.99,32.77 9.27,32.77 8.89,33.15 U7.13
SCL_1.8V  (via drill 0.38)
  Top 0.152: v44.83,39.55 U3.12
  Top 0.254: R10.1 Q2.2 39.97,36.01 v39.98,36.02
  Bottom 0.254: v39.98,36.02 40.77,36.02 41.02,36.02 43.38,36.02 43.81,36.45 43.81,38.99 44.07,39.24 44.53,39.24 v44.83,39.55
SCL_AUX
  Top 0.254: Q2.3 43.17,36.96 R8.1 45.81,36.95 J1.4
SCL_OUT  (via drill 0.25)
  Top 0.152: v37.69,48.06 40.33,48.06 | U3.10 43.15,41.66 41.02,41.66
  Top 0.254: R1.1 21.21,28.04 20.47,28.78 U1.10 20.48,33.75 v20.45,33.78 | 40.33,48.06 U10.2 | 41.02,41.66 37.59,41.66 37.21,41.27 v37.21,40.73
  Bottom 0.254: v20.45,33.78 20.83,34.16 32.77,34.16 33.19,34.58 33.19,38.6 35.19,40.6 37.08,40.6 v37.21,40.73 37.21,47.57 v37.69,48.06
SDA
  Top 0.254: U7.12 10.16,33.68 10.67,33.17 14.61,33.17 14.96,33.53 14.96,34.71 15.58,35.33 20.24,35.33 21.13,34.45 U1.9
SDA_1.8V  (via drill 0.25, 0.38)
  Top 0.152: v41.1,44.68 U3.7
  Top 0.254: Q3.2 37.54,32.45 | 37.54,32.45 R11.1 | v39.27,32.44 37.56,32.44 37.54,32.45
  Bottom 0.152: v39.27,32.44 38.81,32.44 38.61,32.64 38.61,38.47 40.55,40.41 40.55,44.39 40.84,44.68 v41.1,44.68
SDA_AUX
  Top 0.254: J1.3 43.22,34.42 R9.1 42,34.38 41.78,34.16 41.78,33.66 41.53,33.4 Q3.3
SDA_OUT
  Top 0.152: U10.4 36.39,46.55 | U3.11 43.84,40 43.64,39.8 41.07,39.8 41,39.73
  Top 0.254: U1.8 21.77,32.07 21.77,29.97 22.15,29.59 R6.1 25.06,31.23 25.83,32 32.13,32 32.51,32.38 32.51,38.99 32.77,39.24 35.43,39.24 | 41,39.73 40.51,39.24 35.43,39.24 | U3.11 43.84,40.97 | 36.39,46.55 36.07,46.23 36.07,39.88 35.43,39.24
SENSOR_EN1
  Top 0.254: U1.6 21.11,25.3 20.83,25.02 | 20.83,25.02 20.83,24.19 R4.2 20.76,24.26 11.94,24.26 11.43,23.75 U7.8 | 20.83,25.02 20.7,25.02 20.45,25.27 20.45,26.04 U1.5 20.46,28.03 19.18,29.31 U1.12 19.18,32.92 19,33.1 18.64,33.1 18.53,32.98 U1.13
SWDCLK  (via drill 0.25)
  Top 0.254: J3.2 15.71,45.85 D1.C 15.72,41.17 15.44,40.89 11.81,40.89 11.56,40.64 v11.56,40.26 | U7.15 6.35,35.05 v6.6,34.8
  Bottom 0.254: v6.6,34.8 11.18,34.8 11.56,35.18 v11.56,40.26
SWDIO  (via drill 0.25)
  Top 0.254: J3.4 18.92,50.93 19.3,50.55 19.3,40.51 18.92,40.13 v12.95,40.13 | v5.08,34.8 U7.16
  Bottom 0.254: v12.95,40.13 12.57,40.13 12.32,39.88 12.32,34.8 11.79,34.27 5.56,34.27 5.08,34.75 v5.08,34.8
USB_DM
  Top 0.152: U7.7 10.16,21.21 10,21.05 U8.3
USB_DP
  Top 0.152: U7.6 8.89,21.21 9.02,21.08 9.02,18.21 U8.1
V_BATT  (via drill 0.25, 0.3)
  Top 0.203: U4.19 15.27,8.86 15.24,8.89 14.86,8.89 | U4.20 14.77,8.8 14.86,8.89 | 14.86,8.89 v14.22,8.89 14.1,9.02 13.72,9.02 v13.59,8.89
  Top 0.254: U4.14 17.99,6.65 18,6.63 v18.43,6.63
  Top 0.635: Q1.2 18.64,1.44 C11.1 18.18,1.91 v17.53,1.91
  Bottom 0.254: 18.8,7.24 18.29,6.73 18.29,6.63 18.29,6.61 18.29,6.48 18.8,5.97
  Bottom 0.635: v17.53,1.91 18.8,3.17 18.8,5.97 18.8,6.48 | v13.59,8.89 18.03,8.89 18.8,8.13 18.8,7.24 18.8,6.48 | v18.43,6.63 18.29,6.63 | 18.29,6.61 18.66,6.61 18.8,6.48
  pour Top (no thermals): 15.24,9.02 14.48,9.02 14.22,9.27 13.46,9.27 13.34,9.14 13.34,8.64 13.59,8.38 14.61,8.38 14.73,8.26 15.24,8.26 15.37,8.38 15.37,8.89
V_USB
  Top 0.254: 13.21,19.75 13.96,19.75 14.1,19.61 14.1,17.86 | 13.21,19.75 U2.1 | 14.1,17.86 14.1,16.76 13.84,16.51 12.22,16.51 11.89,16.18 J5.1 | U2.3 14.09,17.85 14.1,17.86 | C8.1 13.21,19.75
VCC  (via drill 0.25, 0.3)
  Top 0.203: U4.4 13.52,6.15 13.34,5.97 13.34,5.84 13.53,5.65 U4.5
  Top 0.254: U4.8 15.27,3.58 v15.24,3.56 | U4.11 17.72,5.15 17.91,5.33 v17.91,5.46 17.72,5.65 U4.12
  Top 0.635: 13.34,5.84 12.65,5.16 C10.1 12,4.25 v11.94,4.19
  Bottom 0.254: 14.61,4.45 14.99,4.06 15.24,4.06 15.49,4.06 15.88,4.45
  Bottom 0.635: v11.94,4.19 12.19,4.45 14.61,4.45 15.24,4.45 | v17.91,5.46 17.91,4.83 17.53,4.45 15.88,4.45 15.24,4.45 | v15.24,3.56 15.24,4.06 15.24,4.45
VCC_1  (via drill 0.38)
  Top 0.152: U10.6 42.22,47.3 | U10.1 41.34,48.37 40.98,48.73 | U3.8 41.54,43.68 41.53,43.69 | U3.9 41.77,42.68 41.53,42.93 41.53,43.68 | U3.5 44.84,46.6 44.58,46.86 v44.2,46.86 | U3.1 v48.77,43.69 48.77,44.53 48.61,44.68 U3.2
  Top 0.254: Q2.1 34.99,37.91 v34.92,37.85 | 33.82,34.9 34.38,34.34 | 34.38,34.34 34.33,34.34 | 34.33,34.34 33.82,33.83 | 34.33,34.34 33.85,34.34 33.82,34.37 | 34.38,34.34 Q3.1 | C1.1 40.98,50.74 40.66,51.05 v40.01,51.05 | 42.22,47.3 42.29,47.37 42.29,49.17 41.94,49.53 C1.1 | 40.98,48.73 C1.1 | R6.2 26.76,28.07 R1.2 | 41.54,43.68 41.53,43.68 v40.01,43.68 v40.01,43.69 38.85,43.69 C7.1 | C19.1 49.28,43.18 v48.77,43.69
  Top 0.508: R10.2 33.82,34.9 33.82,34.37 33.82,33.83 R11.2 | U1.1 17.86,26.92 17.35,27.43 16.4,27.43 C16.2 | R6.2 28.45,29.59 28.96,29.08 v28.96,27.94
  Top 0.635: C16.2 16.38,28.57 16.89,29.08 18.41,29.08 v19.56,27.94 | v33.78,30.48 33.82,30.52 R11.2
  Bottom 0.254: 40.01,46.48 40.51,45.97 | 42.16,45.97 40.51,45.97 | 40.51,45.97 40.01,45.47 | v44.2,46.86 43.05,46.86 42.16,45.97 | v48.77,43.69 49.02,43.94 49.02,45.72 48.77,45.97 42.16,45.97
  Bottom 0.635: v19.56,27.94 v28.96,27.94 33.17,27.94 33.81,28.57 33.81,30.45 v33.78,30.48 33.78,36.7 v34.92,37.85 34.92,39.5 35.43,40.01 39.37,40.01 40.01,40.64 v40.01,43.69 40.01,45.47 40.01,46.48 v40.01,51.05
VDD  (via drill 0.25, 0.3, 0.38)
  Top 0.203: U4.2 13.55,7.15 13.46,7.24
  Top 0.381: 12.03,9.79 C6.2 | 13.02,7.68 13.46,7.24
  Top 0.508: IC1.1 IC1.5 36.03,28.41 35.31,27.69 | v22.86,21.21 22.86,22.86 23.37,23.37 34.92,23.37 35.31,23.75 35.31,27.69 | 35.31,27.69 35.05,27.69 33.78,28.96 31.24,28.96 30.73,29.46 v30.73,29.59 | v17.65,42.42 17.65,45.86 R3.1
  Top 0.635: 12.03,9.79 C14.1 12.42,8.28 13.02,7.68 | v13.08,1.52 13.04,1.56 R7.2 | C6.2 v12.05,10.78 v12.06,10.79 | U7.3 5.04,22.17 C3.2 5.04,16.05 C4.2 C5.2 4.95,14.41 v4.95,12.83
  Bottom 0.508: v22.86,21.21 22.23,20.57 20.95,20.57 20.45,20.07 20.45,9.27 19.81,8.64 | v30.73,29.59 30.73,31.62 30.35,32 19.3,32 18.67,32.64 18.67,41.4 v17.65,42.42
  Bottom 0.635: v13.08,1.52 13.59,1.02 18.16,1.02 19.81,2.67 19.81,8.64 18.54,9.91 12.95,9.91 | v12.06,10.79 12.95,9.91 | 12.95,9.91 5.66,9.91 4.95,10.62 v4.95,12.83
VOUT  (via drill 0.25, 0.38)
  Top 0.254: U2.5 C17.1 18.88,19.75 v18.9,19.76 | U8.5 v9.5,20.73 | U7.4 v6.35,20.83
  Bottom 0.254: v18.9,19.76 19.13,19.76 19.43,20.07 19.43,20.75 19.05,21.13 9.91,21.13 v9.5,20.73 9.02,21.21 6.73,21.21 v6.35,20.83

### Text on the board
bNames: WHT | BLU | BRN | BLK | 12-6-2020 | STWIN iNEMO IMU Node